# Altium schematic sheet [04] - TK2560_Power.SchDoc
size A4; SheetNumber: 5; SheetTotal: 15
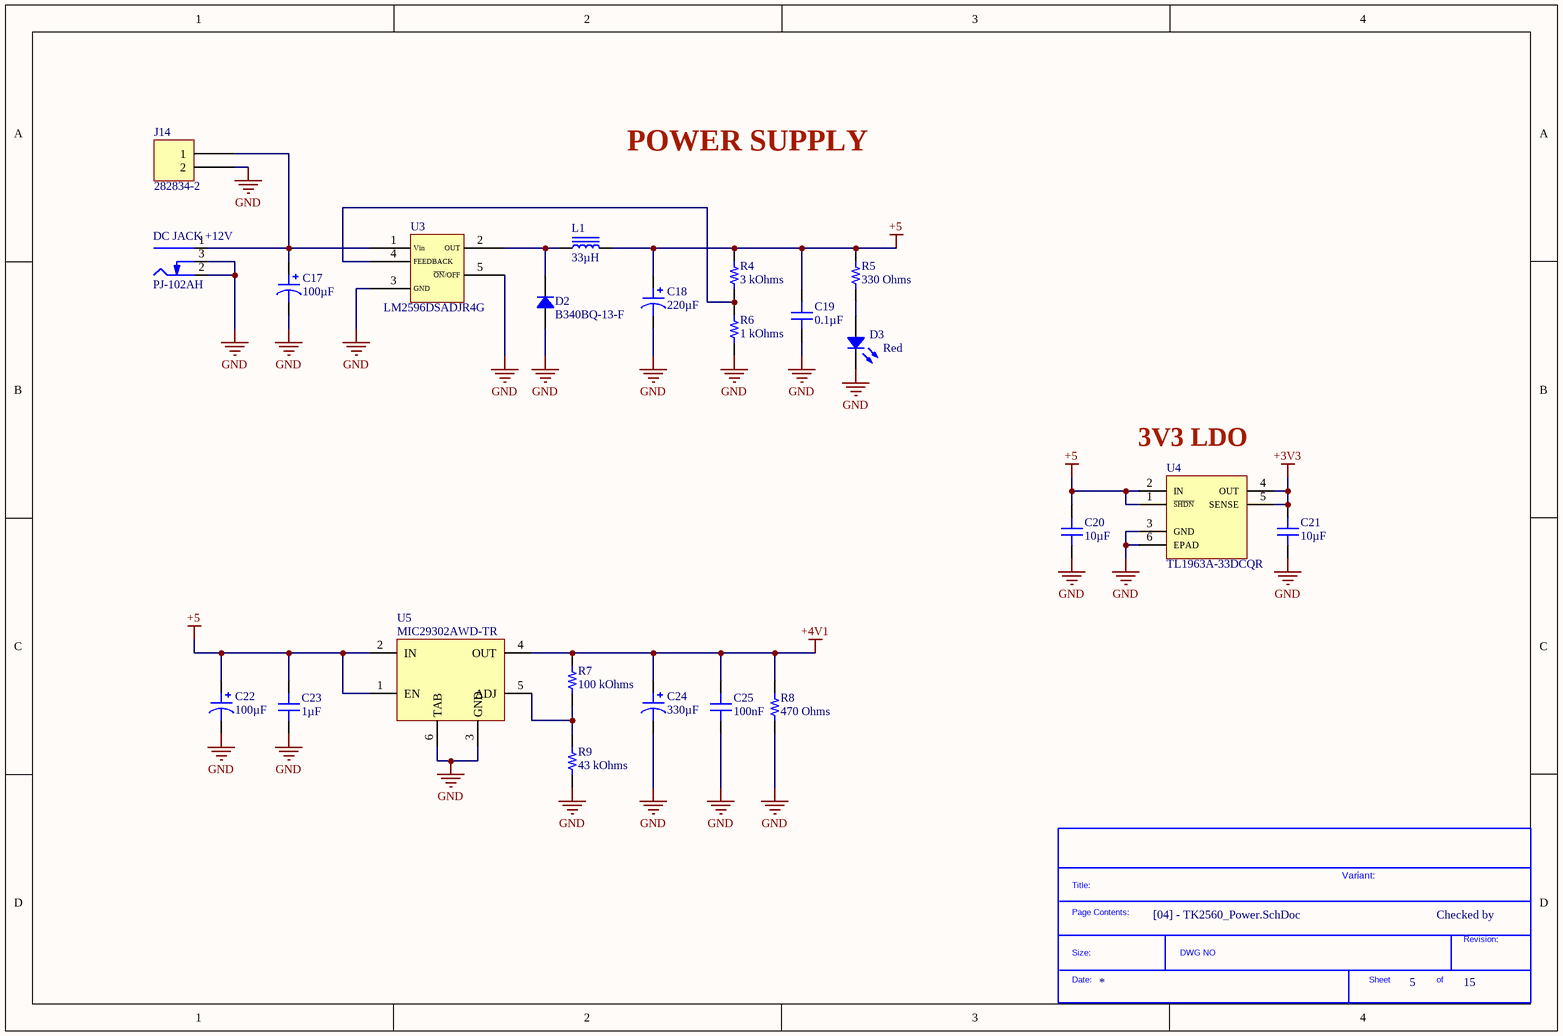
[diagram p0: [04] - TK2560_Power.SchDoc]

## Parts
*?  SDTitleBlock  (value not drawn)  (graphical)
C17  100µF  [CAP ALSMD 8.3MM H10.5MM]
C18  220µF  [CAP ALSMD 8.3MM H10.5MM]
C19  0.1µF  [CAP 0805_2012]
C20  10µF  [CAP 0805_2012]
C21  10µF  [CAP 0805_2012]
C22  100µF  [CAP POL 1411_3528]
C23  1µF  [CAP 0805_2012]
C24  330µF  [CAP POL 1411_3528]
C25  100nF  [CAP 0805_2012]
D2  B340BQ-13-F  [DO214AA SMB]
D3  Red  [LED 1206_3216 RED]
DC_JACK_+12V  PJ-102AH  [CUI PJ-102AH]
J14  282834-2  [TE 282834-2]
L1  33µH  [BOURNS SRR1280]
R4  3 kOhms  [RES 0805_2012]
R5  330 Ohms  [RES 0805_2012]
R6  1 kOhms  [RES 0805_2012]
R7  100 kOhms  [RES 0805_2012]
R8  470 Ohms  [RES 0805_2012]
R9  43 kOhms  [RES 0805_2012]
U3  LM2596DSADJR4G  [D2PAK 5_LEAD]
U4  TL1963A-33DCQR  [DCQ(R-PDSO-G6)]
U5  MIC29302AWD-TR  [TO-252-5]

## Nets
+3V3: C21.2 U4.4(OUT) U4.5(SENSE)
+4V1: C24.1 C25.2 R7.2 R8.2 U5.4(OUT)
+5: C18.1 C19.2 C20.2 C22.1 C23.2 L1.2 R4.2 R5.2 U4.1(~{SHDN}) U4.2(IN) U5.1(EN) U5.2(IN)
GND: C17.2 C18.2 C19.1 C20.1 C21.1 C22.2 C23.1 C24.2 C25.1 D2.1 D3.2 DC_JACK_+12V.2(Outer) DC_JACK_+12V.3(SW) J14.2 R6.1 R8.1 R9.1 U3.3(GND) U3.5(~{ON}/OFF) U4.3(GND) U4.6(EPAD) U5.3(GND) U5.6(TAB)
NetC17_1: C17.1 DC_JACK_+12V.1(Centre) J14.1 U3.1(Vin)
NetD2_2: D2.2 L1.1 U3.2(OUT)
NetD3_1: D3.1 R5.1
NetR4_1: R4.1 R6.2 U3.4(FEEDBACK)
NetR7_1: R7.1 R9.2 U5.5(ADJ)

## Notes on the sheet
- POWER SUPPLY
- (near U4) 3V3 LDO
- Variant:
- Checked by
- (in symbol SDTitleBlock) Title:; Page Contents:; Revision:; Size:; DWG NO; Date:; Sheet; of

## Library data of the parts
C17 = UWZ1H101MCL1GS: CAP ALUM 100UF 20% 50V SMD; Manufacturer: Nichicon; Lifetime @ Temp.: 1000 Hrs @ 105°C; Polarization: Polar; Ripple Current @ High Frequency: 210mA @ 10kHz; Ripple Current @ Low Frequency: 140mA @ 120Hz; Surface Mount Land Size: 0.327" L x 0.327" W (8.30mm x 8.30mm); Part Number: UWZ1H101MCL1GS; Applications: High Temperature Reflow; Capacitance: 100µF; ComponentLink1Description: Datasheet; ComponentLink1URL: http://nichicon-us.com/english/products/pdfs/e-uwz.pdf; ComponentLink2Description: DigiKey Link; ComponentLink2URL: http://digikey.com/product-detail/en/nichicon/UWZ1H101MCL1GS/493-6336-1-ND/3438850; Device Package: Radial, Can - SMD; Height - Seated (Max): 0.413" (10.50mm); LastUpdated: 02/09/2020 01:25:15; Lifecycle Status: Active; Minimum Order: 1; Mounting Type: Surface Mount; Operating Temperature: -55°C ~ 105°C; Package / Case: Radial, Can - SMD; Packaging: TapeAndReel; PartId: 7569; Part Status: Active; Price: 0.20; Series: UWZ; Size / Dimension: 0.315" Dia (8.00mm); Supplier 1: DigiKey; Supplier Part Number 1: 493-6336-1-ND; Tolerance: ±20%; Value: 100µF; Voltage - Rated: 50V
C18 = UUR1E221MNL6GS: CAP ALUM 220UF 20% 25V SMD; Manufacturer: Nichicon; Lifetime @ Temp.: 2000 Hrs @ 85°C; Ripple Current @ High Frequency: 301.6mA @ 10kHz; Ripple Current @ Low Frequency: 232mA @ 120Hz; Surface Mount Land Size: 0.327" L x 0.327" W (8.30mm x 8.30mm); Part Number: UUR1E221MNL6GS; Applications: General Purpose; Capacitance: 220µF; ComponentLink1Description: Datasheet; ComponentLink1URL: http://nichicon-us.com/english/products/pdfs/e-uur.pdf; ComponentLink2Description: DigiKey Link; ComponentLink2URL: http://digikey.com/product-detail/en/nichicon/UUR1E221MNL6GS/493-6222-1-ND/3438735; Device Package: Radial, Can - SMD; Height - Seated (Max): 0.413" (10.50mm); LastUpdated: 02/09/2020 01:25:16; Lifecycle Status: Active; Minimum Order: 1; Mounting Type: Surface Mount; Operating Temperature: -40°C ~ 85°C; Package / Case: Radial, Can - SMD; Packaging: TapeAndReel; PartId: 7456; Part Status: Active; Price: 0.19; Series: UUR; Size / Dimension: 0.315" Dia (8.00mm); Supplier 1: DigiKey; Supplier Part Number 1: 493-6222-1-ND; Tolerance: ±20%; Value: 220µF; Voltage - Rated: 25V
C19 = 160R15W104KV4T: CAP CER 0.1UF 16V X7R 0805; Manufacturer: Johanson Dielectrics Inc.; Tolerance: ±10%; Part Number: 160R15W104KV4T; Value: 0.1µF; Applications: General Purpose; Capacitance: 0.1µF; ComponentLink1Description: Datasheet; ComponentLink1URL: https://www.johansondielectrics.com/downloads/catalog/johanson-dielectrics-product-catalog.pdf; ComponentLink2Description: DigiKey Link; ComponentLink2URL: http://digikey.com/product-detail/en/johanson-dielectrics-inc/160R15W104KV4T/709-1183-1-ND/1859515; Device Package: 0805 (2012 Metric); LastUpdated: 02/09/2020 01:04:30; Lifecycle Status: Active; Minimum Order: 1; Mounting Type: Surface Mount, MLCC; Operating Temperature: -55°C ~ 125°C; Package / Case: 0805 (2012 Metric); Packaging: TapeAndReel; PartId: 9125; Part Status: Active; Price: 0.03; Series: -; Size / Dimension: 0.080" L x 0.050" W (2.03mm x 1.27mm); Supplier 1: DigiKey; Supplier Part Number 1: 709-1183-1-ND; Temperature Coefficient: X7R; Thickness (Max): 0.050" (1.27mm); Voltage - Rated: 16V
C20 C21 = 0805BW106K160NGT: CAP CER 10UF 16V X5R 0805; Manufacturer: Knowles Novacap; Tolerance: ±10%; Part Number: 0805BW106K160NGT; Value: 10µF; Applications: General Purpose; Capacitance: 10µF; ComponentLink1Description: Datasheet; ComponentLink1URL: https://www.knowlescapacitors.com/getattachment/6c8d48ef-fc2b-4752-ae2c-ce6c208de0c4/High-Capacitance-Chip.aspx; ComponentLink2Description: DigiKey Link; ComponentLink2URL: http://digikey.com/product-detail/en/knowles-novacap/0805BW106K160NGT/1763-1170-1-ND/7303990; Device Package: 0805 (2012 Metric); Features: Gold Flash Termination; LastUpdated: 02/09/2020 01:04:27; Lifecycle Status: Active; Minimum Order: 1; Mounting Type: Surface Mount, MLCC; Operating Temperature: -55°C ~ 85°C; Package / Case: 0805 (2012 Metric); Packaging: TapeAndReel; PartId: 10571; Part Status: Active; Price: 1.32; Series: -; Size / Dimension: 0.080" L x 0.050" W (2.03mm x 1.27mm); Supplier 1: DigiKey; Supplier Part Number 1: 1763-1170-1-ND; Temperature Coefficient: X5R; Thickness (Max): 0.054" (1.37mm); Voltage - Rated: 16V
C22 = T494B107M006AT: CAP TANT 100UF 20% 6.3V 1411; Manufacturer: KEMET; Manufacturer Size Code: B; ESR (Equivalent Series Resistance): 1.5Ohm; Lifetime @ Temp.: 2000 Hrs @ 125°C; Type: Molded; Part Number: T494B107M006AT; Value: 100µF; Capacitance: 100µF; ComponentLink1Description: Datasheet; ComponentLink1URL: https://api.kemet.com/component-edge/download/datasheet/T494B107M006AT.pdf; ComponentLink2Description: DigiKey Link; ComponentLink2URL: http://digikey.com/product-detail/en/kemet/T494B107M006AT/399-3833-1-ND/819158; Device Package: 1411 (3528 Metric); Features: General Purpose; Height - Seated (Max): 0.083" (2.10mm); LastUpdated: 02/09/2020 01:15:46; Lifecycle Status: Active; Minimum Order: 1; Mounting Type: Surface Mount; Operating Temperature: -55°C ~ 125°C; Package / Case: 1411 (3528 Metric); Packaging: TapeAndReel; PartId: 7; Part Status: Active; Price: 0.48; Series: T494; Size / Dimension: 0.138" L x 0.110" W (3.50mm x 2.80mm); Supplier 1: DigiKey; Supplier Part Number 1: 399-3833-1-ND; Tolerance: ±20%; Voltage - Rated: 6.3V
C23 = 0805YD105KAT4A: CAP CER 1UF 16V X5R 0805; Manufacturer: AVX Corporation; Tolerance: ±10%; Part Number: 0805YD105KAT4A; Value: 1µF; Applications: General Purpose; Capacitance: 1µF; ComponentLink1Description: Datasheet; ComponentLink1URL: http://datasheets.avx.com/cx5r.pdf; ComponentLink2Description: DigiKey Link; ComponentLink2URL: http://digikey.com/product-detail/en/avx-corporation/0805YD105KAT4A/478-11535-1-ND/8108827; Device Package: 0805 (2012 Metric); LastUpdated: 02/09/2020 01:04:15; Lifecycle Status: Active; Minimum Order: 1; Mounting Type: Surface Mount, MLCC; Operating Temperature: -55°C ~ 85°C; Package / Case: 0805 (2012 Metric); Packaging: TapeAndReel; PartId: 15586; Part Status: Active; Price: 0.05; Series: -; Size / Dimension: 0.079" L x 0.049" W (2.01mm x 1.25mm); Supplier 1: DigiKey; Supplier Part Number 1: 478-11535-1-ND; Temperature Coefficient: X5R; Thickness (Max): 0.055" (1.40mm); Voltage - Rated: 16V
C24 = F950G337KTAAQ2: CAP TANT 330UF 10% 4V 1411; Manufacturer: AVX Corporation; Manufacturer Size Code: T; ESR (Equivalent Series Resistance): 800mOhm; Type: Conformal Coated; Part Number: F950G337KTAAQ2; Value: 330µF; Capacitance: 330µF; ComponentLink1Description: Datasheet; ComponentLink1URL: http://datasheets.avx.com/F95.pdf; ComponentLink2Description: DigiKey Link; ComponentLink2URL: http://digikey.com/product-detail/en/avx-corporation/F950G337KTAAQ2/478-8377-1-ND/4005744; Device Package: 1411 (3528 Metric); Features: General Purpose; Height - Seated (Max): 0.063" (1.60mm); LastUpdated: 02/09/2020 01:15:46; Lifecycle Status: Active; Minimum Order: 1; Mounting Type: Surface Mount; Operating Temperature: -55°C ~ 125°C; Package / Case: 1411 (3528 Metric); Packaging: TapeAndReel; PartId: 9; Part Status: Active; Price: 0.48; Series: F95, Frameless™; Size / Dimension: 0.138" L x 0.106" W (3.50mm x 2.70mm); Supplier 1: DigiKey; Supplier Part Number 1: 478-8377-1-ND; Tolerance: ±10%; Voltage - Rated: 4V
C25 = AC0805KKX8R9BB104: CAP CER 0805 10% X8R 50V 100NF; Manufacturer: Yageo; Capacitance: 0.1µF; Part Number: AC0805KKX8R9BB104; Value: 100nF; Applications: Automotive; ComponentLink1Description: Datasheet; ComponentLink1URL: http://www.yageo.com/documents/recent/AC0805KKX8R9BB104.pdf; ComponentLink2Description: DigiKey Link; ComponentLink2URL: http://digikey.com/product-detail/en/yageo/AC0805KKX8R9BB104/311-4624-1-ND/9699550; Device Package: 0805 (2012 Metric); LastUpdated: 02/09/2020 01:04:20; Lifecycle Status: Active; Minimum Order: 1; Mounting Type: Surface Mount, MLCC; Operating Temperature: -55°C ~ 150°C; Package / Case: 0805 (2012 Metric); Packaging: TapeAndReel; PartId: 14076; Part Status: Active; Price: 0.06; Ratings: AEC-Q200; Series: AC; Size / Dimension: 0.079" L x 0.049" W (2.00mm x 1.25mm); Supplier 1: DigiKey; Supplier Part Number 1: 311-4624-1-ND; Temperature Coefficient: X8R; Thickness (Max): 0.057" (1.45mm); Tolerance: ±10%; Voltage - Rated: 50V
D2 = B340BQ-13-F: DIODE SCHOTTKY 40V 3A SMB; Manufacturer: Diodes Incorporated; Capacitance @ Vr, F: 200pF @ 4V, 1MHz; Current - Reverse Leakage @ Vr: 500µA @ 40V; Speed: Fast Recovery =< 500ns, > 200mA (Io); Voltage - Forward (Vf) (Max) @ If: 500mV @ 3A; Part Number: B340BQ-13-F; ComponentLink1Description: Datasheet; ComponentLink1URL: https://www.diodes.com/assets/Datasheets/B340BQ-B360BQ.pdf; ComponentLink2Description: DigiKey Link; ComponentLink2URL: http://digikey.com/product-detail/en/diodes-incorporated/B340BQ-13-F/B340BQ-13-FDICT-ND/6012577; Current - Average Rectified (Io): 3A; Diode Type: Schottky; LastUpdated: 02/09/2020 01:18:53; Lifecycle Status: Active; Minimum Order: 1; Mounting Type: Surface Mount; Operating Temperature - Junction: -55°C ~ 150°C; Package / Case: DO-214AA, SMB; Packaging: TapeAndReel; PartId: 1474; Part Status: Active; Price: 0.12; Series: Automotive, AEC-Q101; Supplier 1: DigiKey; Supplier Part Number 1: B340BQ-13-FDICT-ND; Supplier Device Package: SMB; Voltage - DC Reverse (Vr) (Max): 40V
D3 = APTL3216SURCK-01: LED SMD; Manufacturer: Kingbright; Configuration: 1206; Current - Test: 20mA; Lens Color: Colorless; Lens Size: 1.10mm Dia; Lens Style: Round with Domed Top; Lens Transparency: Clear; Millicandela Rating: 230mcd; Viewing Angle: 80°; Voltage - Forward (Vf) (Typ): 1.95V; Wavelength - Dominant: 630nm; Wavelength - Peak: 645nm; Part Number: APTL3216SURCK-01; Color: Red; ComponentLink1Description: Datasheet; ComponentLink1URL: http://www.kingbrightusa.com/images/catalog/SPEC/APTL3216SURCK-01.pdf; ComponentLink2Description: DigiKey Link; ComponentLink2URL: http://digikey.com/product-detail/en/kingbright/APTL3216SURCK-01/754-APTL3216SURCK-01CT-ND/10293135; Device Package: 1206 (3216 Metric); Height (Max): 1.20mm; LastUpdated: 9/2/2020 01:21:09; Lifecycle Status: Active; Minimum Order: 1; Mounting Type: Surface Mount; Package / Case: 1206 (3216 Metric); Packaging: TapeAndReel; PartId: 229; Part Status: Active; Price: 0.08; Series: Heli-R; Size / Dimension: 3.20mm L x 1.60mm W; Supplier 1: DigiKey; Supplier Part Number 1: 754-APTL3216SURCK-01CT-ND; Supplier Device Package: 1206; Value: Red
DC_JACK_+12V = PJ-102AH: CONN PWR JACK 2X5.5MM SOLDER; Manufacturer: CUI Devices; Actual Diameter: 0.079" (2.00mm ID), 0.256" (6.50mm OD); Current Rating (Amps): 5A; Gender: Male; Industry Recognized Mating Diameter: 2.00mm ID (0.079"), 5.50mm OD (0.217"); Internal Switch(s): Single Switch, Normally Closed; Material Flammability Rating: UL94 V-0; Mating Length/Depth: 0.354" (9.00mm); Number of Positions/Contacts: 2 Conductors, 3 Contacts; Shielding: Unshielded; Voltage - Rated: 24VDC; Part Number: PJ-102AH; ComponentLink1Description: Datasheet; ComponentLink1URL: https://www.cuidevices.com/product/resource/digikeypdf/pj-102ah.pdf; ComponentLink2Description: DigiKey Link; ComponentLink2URL: //digikey.com/product-detail/en/cui-devices/PJ-102AH/CP-102AH-ND/408448; Connector Type: Jack; LastUpdated: 16/12/2019 19:01:27; Lifecycle Status: 0; Minimum Order: 1; Mounting Type: Through Hole, Right Angle; Packaging: Tray; Part Status: Active; Price: 0.76; Series: -; Supplier 1: DigiKey; Supplier Part Number 1: CP-102AH-ND; Termination: Solder
J14 = 282834-2: TERM BLK 2P SIDE ENT 2.54MM PCB; Manufacturer: TE Connectivity AMP Connectors; Current: 10A; Mating Orientation: Horizontal with Board; Number of Levels: 1; Pitch: 0.100" (2.54mm); Positions Per Level: 2; Voltage: 150V; Wire Gauge: 16-30 AWG; Wire Termination: Screw - Rising Cage Clamp; Part Number: 282834-2; Color: Green; ComponentLink1Description: Datasheet; ComponentLink1URL: https://www.te.com/commerce/DocumentDelivery/DDEController?Action=srchrtrv&DocNm=282834&DocType=Customer+Drawing&DocLang=English; ComponentLink2Description: DigiKey Link; ComponentLink2URL: http://digikey.com/product-detail/en/te-connectivity-amp-connectors/282834-2/A98333-ND/1150135; LastUpdated: 15/01/2020 04:15:38; Lifecycle Status: Active; Minimum Order: 1; Mounting Type: Through Hole; Packaging: Bulk; Part Status: Active; Price: 0.88; Series: Buchanan; Supplier 1: DigiKey; Supplier Part Number 1: A98333-ND
L1 = SRR1280-330M: FIXED IND 33UH 3.5A 57 MOHM SMD; Manufacturer: Bourns Inc.; Current - Saturation: 3.3A; DC Resistance (DCR): 57mOhm Max; Frequency - Self Resonant: 9.5MHz; Inductance Frequency - Test: 100kHz; Material - Core: Ferrite; Q @ Freq: 28 @ 2.52MHz; Shielding: Shielded; Tolerance: ±20%; Type: Wirewound; Part Number: SRR1280-330M; ComponentLink1Description: Datasheet; ComponentLink1URL: https://www.bourns.com/docs/Product-Datasheets/SRR1280.pdf; ComponentLink2Description: DigiKey Link; ComponentLink2URL: http://digikey.com/product-detail/en/bourns-inc/SRR1280-330M/SRR1280-330MCT-ND/2127440; Current Rating (Amps): 3.5A; Device Package: Nonstandard; Height - Seated (Max): 0.315" (8.00mm); Inductance: 33µH; LastUpdated: 02/09/2020 01:22:09; Lifecycle Status: Active; Minimum Order: 1; Mounting Type: Surface Mount; Operating Temperature: -40°C ~ 125°C; Package / Case: Nonstandard; Packaging: TapeAndReel; PartId: 25; Part Status: Active; Price: 0.65; Series: SRR1280; Size / Dimension: 0.492" L x 0.492" W (12.50mm x 12.50mm); Supplier 1: DigiKey; Supplier Part Number 1: SRR1280-330MCT-ND; Value: 33µH
R4 = ERJ-PB6D3001V: RES SMD 3K OHM 0.5% 1/4W 0805; Manufacturer: Panasonic Electronic Components; Power (Watts): 0.25W, 1/4W; Temperature Coefficient: ±50ppm/°C; Part Number: ERJ-PB6D3001V; Value: 3 kOhms; ComponentLink1Description: Datasheet; ComponentLink1URL: https://industrial.panasonic.com/cdbs/www-data/pdf/RDM0000/AOA0000C328.pdf; ComponentLink2Description: DigiKey Link; ComponentLink2URL: http://digikey.com/product-detail/en/panasonic-electronic-components/ERJ-PB6D3001V/P21071CT-ND/6215326; Composition: Thick Film; Device Package: 0805 (2012 Metric); Features: Automotive AEC-Q200, Pulse Withstanding; Height - Seated (Max): 0.028" (0.70mm); LastUpdated: 02/09/2020 01:14:32; Lifecycle Status: Active; Minimum Order: 1; Number of Terminations: 2; Operating Temperature: -55°C ~ 155°C; Package / Case: 0805 (2012 Metric); Packaging: TapeAndReel; PartId: 48478; Part Status: Active; Price: 0.03; Ratings: AEC-Q200; Resistance: 3 kOhms; Series: ERJ; Size / Dimension: 0.079" L x 0.049" W (2.00mm x 1.25mm); Supplier 1: DigiKey; Supplier Part Number 1: P21071CT-ND; Supplier Device Package: 0805; Tolerance: ±0.5%
R5 = ERJ-6GEYJ331V: RES SMD 330 OHM 5% 1/8W 0805; Manufacturer: Panasonic Electronic Components; Power (Watts): 0.125W, 1/8W; Temperature Coefficient: ±200ppm/°C; Part Number: ERJ-6GEYJ331V; Value: 330 Ohms; ComponentLink1Description: Datasheet; ComponentLink1URL: http://industrial.panasonic.com/www-cgi/jvcr13pz.cgi?E+PZ+3+AOA0001+ERJ6GEYJ331V+7+WW; ComponentLink2Description: DigiKey Link; ComponentLink2URL: http://digikey.com/product-detail/en/panasonic-electronic-components/ERJ-6GEYJ331V/P330ACT-ND/90025; Composition: Thick Film; Device Package: 0805 (2012 Metric); Features: Automotive AEC-Q200; Height - Seated (Max): 0.028" (0.70mm); LastUpdated: 02/09/2020 01:15:19; Lifecycle Status: Active; Minimum Order: 1; Number of Terminations: 2; Operating Temperature: -55°C ~ 155°C; Package / Case: 0805 (2012 Metric); Packaging: TapeAndReel; PartId: 30017; Part Status: Active; Price: 0.01; Ratings: AEC-Q200; Resistance: 330 Ohms; Series: ERJ; Size / Dimension: 0.079" L x 0.049" W (2.00mm x 1.25mm); Supplier 1: DigiKey; Supplier Part Number 1: P330ACT-ND; Supplier Device Package: 0805; Tolerance: ±5%
R6 = RNCP0805FTD1K00: RES 1K OHM 1% 1/4W 0805; Manufacturer: Stackpole Electronics Inc; Power (Watts): 0.25W, 1/4W; Temperature Coefficient: ±100ppm/°C; Part Number: RNCP0805FTD1K00; Value: 1 kOhms; ComponentLink1Description: Datasheet; ComponentLink1URL: https://www.seielect.com/catalog/sei-rncp.pdf; ComponentLink2Description: DigiKey Link; ComponentLink2URL: http://digikey.com/product-detail/en/stackpole-electronics-inc/RNCP0805FTD1K00/RNCP0805FTD1K00CT-ND/2240568; Composition: Thin Film; Device Package: 0805 (2012 Metric); Features: Anti-Sulfur, Moisture Resistant; Height - Seated (Max): 0.024" (0.60mm); LastUpdated: 02/09/2020 01:15:23; Lifecycle Status: Active; Minimum Order: 1; Number of Terminations: 2; Operating Temperature: -55°C ~ 155°C; Package / Case: 0805 (2012 Metric); Packaging: TapeAndReel; PartId: 28023; Part Status: Active; Price: 0.01; Resistance: 1 kOhms; Series: RNCP; Size / Dimension: 0.079" L x 0.049" W (2.00mm x 1.25mm); Supplier 1: DigiKey; Supplier Part Number 1: RNCP0805FTD1K00CT-ND; Supplier Device Package: 0805; Tolerance: ±1%
R7 = RCS0805100KFKEA: RES SMD 100K OHM 1% 0.4W 0805; Manufacturer: Vishay Dale; Power (Watts): 0.4W, 2/5W; Temperature Coefficient: ±100ppm/°C; Part Number: RCS0805100KFKEA; Value: 100 kOhms; ComponentLink1Description: Datasheet; ComponentLink1URL: http://www.vishay.com/docs/20065/rcse3.pdf; ComponentLink2Description: DigiKey Link; ComponentLink2URL: http://digikey.com/product-detail/en/vishay-dale/RCS0805100KFKEA/541-2850-1-ND/5867143; Composition: Thick Film; Device Package: 0805 (2012 Metric); Features: Automotive AEC-Q200, Pulse Withstanding; Height - Seated (Max): 0.020" (0.50mm); LastUpdated: 02/09/2020 01:15:24; Lifecycle Status: Active; Minimum Order: 1; Number of Terminations: 2; Operating Temperature: -55°C ~ 155°C; Package / Case: 0805 (2012 Metric); Packaging: TapeAndReel; PartId: 27789; Part Status: Active; Price: 0.03; Ratings: AEC-Q200; Resistance: 100 kOhms; Series: RCS e3; Size / Dimension: 0.079" L x 0.049" W (2.00mm x 1.25mm); Supplier 1: DigiKey; Supplier Part Number 1: 541-2850-1-ND; Supplier Device Package: 0805; Tolerance: ±1%
R8 = CRCW0805470RFKEAHP: RES SMD 470 OHM 1% 1/2W 0805; Manufacturer: Vishay Dale; Power (Watts): 0.5W, 1/2W; Temperature Coefficient: ±100ppm/°C; Part Number: CRCW0805470RFKEAHP; Value: 470 Ohms; ComponentLink1Description: Datasheet; ComponentLink1URL: http://www.vishay.com/docs/20043/crcwhpe3.pdf; ComponentLink2Description: DigiKey Link; ComponentLink2URL: http://digikey.com/product-detail/en/vishay-dale/CRCW0805470RFKEAHP/541-470TCT-ND/2222848; Composition: Thick Film; Device Package: 0805 (2012 Metric); Features: Automotive AEC-Q200, Pulse Withstanding; Height - Seated (Max): 0.020" (0.50mm); LastUpdated: 02/09/2020 01:15:18; Lifecycle Status: Active; Minimum Order: 1; Number of Terminations: 2; Operating Temperature: -55°C ~ 155°C; Package / Case: 0805 (2012 Metric); Packaging: TapeAndReel; PartId: 30309; Part Status: Active; Price: 0.03; Ratings: AEC-Q200; Resistance: 470 Ohms; Series: CRCW-HP; Size / Dimension: 0.079" L x 0.049" W (2.00mm x 1.25mm); Supplier 1: DigiKey; Supplier Part Number 1: 541-470TCT-ND; Supplier Device Package: 0805; Tolerance: ±1%
R9 = RT0805BRD0743KL: RES SMD 43K OHM 0.1% 1/8W 0805; Manufacturer: Yageo; Power (Watts): 0.125W, 1/8W; Temperature Coefficient: ±25ppm/°C; Part Number: RT0805BRD0743KL; Value: 43 kOhms; ComponentLink1Description: Datasheet; ComponentLink1URL: https://www.yageo.com/upload/media/product/productsearch/datasheet/rchip/PYu-RT_1-to-0.01_RoHS_L_11.pdf; ComponentLink2Description: DigiKey Link; ComponentLink2URL: http://digikey.com/product-detail/en/yageo/RT0805BRD0743KL/YAG1899CT-ND/5139347; Composition: Thin Film; Device Package: 0805 (2012 Metric); Height - Seated (Max): 0.024" (0.60mm); LastUpdated: 02/09/2020 01:15:12; Lifecycle Status: Active; Minimum Order: 1; Number of Terminations: 2; Operating Temperature: -55°C ~ 155°C; Package / Case: 0805 (2012 Metric); Packaging: TapeAndReel; PartId: 33531; Part Status: Active; Price: 0.05; Resistance: 43 kOhms; Series: RT; Size / Dimension: 0.079" L x 0.049" W (2.00mm x 1.25mm); Supplier 1: DigiKey; Supplier Part Number 1: YAG1899CT-ND; Supplier Device Package: 0805; Tolerance: ±0.1%
U3 = LM2596DSADJR4G: Sw. Regulator 3A Adj. Step-Down D2PAK-5; Manufacturer: ON Semiconductor; Number of Outputs: 1; Max Input Voltage: 40V; Min Input Voltage: 4.5V; Output Voltage: 37V; Efficiency: 73%; Switching Frequency: 150kHz; Synchronous Rectifier: No; Min Output Voltage: 1.23V; Topology: Buck-Boost; Output Type: Adjustable; Supplier 1: Digi-Key; Manufacturer Part Number: LM2596DSADJR4G; RoHS: Yes; Category: Voltage Regulators - Switching; Stock 1: 3215; Pricing 1: 1=2.24000, 10=2.01100, 25=1.89760, 100=1.59390 (USD); Mount: Surface Mount; Case/Package: D2PAK; Number of Pins: 5; Min Operating Temperature: -40°C; Max Operating Temperature: 125°C; Max Output Current: 3A; Packaging: Tape and Reel; Output Current: 3A; Package Quantity: 800; Max Output Voltage: 37V; Operating Supply Voltage: 40V; Series: LM2596; Switching Frequency-Max: 150kHz; Length: 10.24mm; Width: 4.572mm; Height: 9.347mm; Radiation Hardening: No; REACH SVHC: No SVHC; Lead Free: Lead Free; Halogen Free: Halogen Free; RoHS Compliant: Yes; ComponentLink1URL: https://datasheet.ciiva.com/15113/getdatasheetpartid-224280-15113862.pdf?src-supplier=Verical; ComponentLink1Description: https://datasheet.ciiva.com/15113/getdatasheetpartid-224280-15113862.pdf?src-supplier=Verical; ComponentLink2URL: https://datasheet.ciiva.com/6603/lm2596-d-6603896.pdf?src-supplier=Digi-Key; ComponentLink2Description: https://datasheet.ciiva.com/6603/lm2596-d-6603896.pdf?src-supplier=Digi-Key; ComponentLink3URL: https://datasheet.ciiva.com/6603/lm2596-d-6603897.pdf?src-supplier=Digi-Key; ComponentLink3Description: https://datasheet.ciiva.com/6603/lm2596-d-6603897.pdf?src-supplier=Digi-Key; ComponentLink4URL: https://datasheet.ciiva.com/6603/lm2596-d-6603898.pdf?src-supplier=Digi-Key; ComponentLink4Description: https://datasheet.ciiva.com/6603/lm2596-d-6603898.pdf?src-supplier=Digi-Key; ComponentLink5URL: https://datasheet.ciiva.com/8270/lm2596-d-8270188.pdf?src-supplier=Avnet; ComponentLink5Description: https://datasheet.ciiva.com/8270/lm2596-d-8270188.pdf?src-supplier=Avnet; Supplier Part Number 1: LM2596DSADJR4GOSCT-ND
U4 = TL1963A-33DCQR: IC REG LINEAR 3.3V 1.5A SOT223-6; Manufacturer: Texas Instruments; Dropout Voltage: 340mV; Number of Outputs: 1; Max Input Voltage: 20V; Min Input Voltage: 2.1V; Min Current Limit: 1.6A; Input Bias Current: 1mA; Polarity: Positive; Accuracy: 3%; Output Type: Fixed; Supplier 1: Arrow Electronics; Manufacturer Part Number: TL1963A-33DCQR; RoHS: Yes; Category: Voltage Regulators - Linear; Stock 1: 1994; Pricing 1: 1=3.03940, 10=2.70250, 25=2.66220, 100=2.15850, 250=2.13670, 500=1.82850, 1000=1.81010, 2500=2.81000, 25000=2.65000, 250000=1.72200, 1250000=1.24700, 2500000=1.24300 (USD); Case/Package: SOT-223; Number of Pins: 6; Contact Plating: Gold; Min Operating Temperature: -40°C; Max Operating Temperature: 125°C; Package Quantity: 1; Packaging: Tape and Reel; Output Voltage: 3.3V; Output Current: 1.5A; Max Output Current: 1.5A; Number of Regulators: 1; Quiescent Current: 1mA; Max Output Voltage: 3.3V; Min Output Voltage: 3.3V; Series: -; Radiation Hardening: No; Lead Free: Lead Free; RoHS Compliant: Yes; ComponentLink1URL: https://datasheet.ciiva.com/2046/tl1963a-2046161.pdf?src-supplier=Digi-Key; ComponentLink1Description: https://datasheet.ciiva.com/2046/tl1963a-2046161.pdf?src-supplier=Digi-Key; ComponentLink2URL: https://datasheet.ciiva.com/2046/tl1963a-2046162.pdf?src-supplier=Digi-Key; ComponentLink2Description: https://datasheet.ciiva.com/2046/tl1963a-2046162.pdf?src-supplier=Digi-Key; ComponentLink3URL: https://datasheet.ciiva.com/2046/tl1963a-2046163.pdf?src-supplier=Digi-Key; ComponentLink3Description: https://datasheet.ciiva.com/2046/tl1963a-2046163.pdf?src-supplier=Digi-Key; ComponentLink4URL: https://datasheet.ciiva.com/26176/tl1963a-25-26176569.pdf?src-supplier=Avnet+Europe; ComponentLink4Description: https://datasheet.ciiva.com/26176/tl1963a-25-26176569.pdf?src-supplier=Avnet+Europe; Supplier Part Number 1: TL1963A-33DCQR
U5 = MIC29302AWD-TR: IC REG LINEAR POS ADJ 3A TO252-5; Manufacturer: Microchip; Number of Outputs: 1; Min Input Voltage: 3V; Output Voltage: 15V; Dropout Voltage: 450mV; Polarity: Positive; Output Voltage Accuracy: 2%; Supplier 1: Digi-Key; Manufacturer Part Number: MIC29302AWD-TR; RoHS: No; Category: Voltage Regulators - Linear; Stock 1: 2431; Pricing 1: 1=1.96000, 25=1.64000, 100=1.49000 (USD); Mount: Surface Mount; Case/Package: TO-263-6; Min Operating Temperature: -40°C; Max Operating Temperature: 125°C; Packaging: Tape and Reel; Output Current: 3A; Number of Regulators: 1; Min Current Limit: 3A; Series: -; Lead Free: Lead Free; RoHS Compliant: No; ComponentLink1URL: https://datasheet.ciiva.com/6582/mic29302a-6582272.pdf?src-supplier=Digi-Key; ComponentLink1Description: https://datasheet.ciiva.com/6582/mic29302a-6582272.pdf?src-supplier=Digi-Key; ComponentLink2URL: https://datasheet.ciiva.com/6582/mic29302a-6582270.pdf?src-supplier=Digi-Key; ComponentLink2Description: https://datasheet.ciiva.com/6582/mic29302a-6582270.pdf?src-supplier=Digi-Key; Supplier Part Number 1: 576-4106-1-ND